# Altium schematic sheet Translate to rigid Flex gesture recognition.SchDoc
size 594 x 420 mm; SheetNumber: 1; SheetTotal: 16; SPICEModelCacheRCYREFEF: <root> / <DocumentId>RCYREFEF</DocumentId> / <CacheFrame Number="0"> / <Model Name="switch_array_u_sw_array_s11" Kind="CKT"> / <Text>*$ / .subckt SWITCH_ARRAY_U_SW_ARRAY_S11 1 2 3 4 / S_U_SW_ARRAY_S11         3 4 1 2 _U_SW_ARRAY_S11 / RS_U_SW_ARRAY_S11         1 2 1G / .MODEL         _U_SW_ARRAY_S11 VSWITCH Roff=1e12 Ron=300m Voff=0.2V Von=0.8V / .ends SWITCH_ARRAY_U_SW_ARRAY_S11</Text> / </Model> / </CacheFrame> / </root>
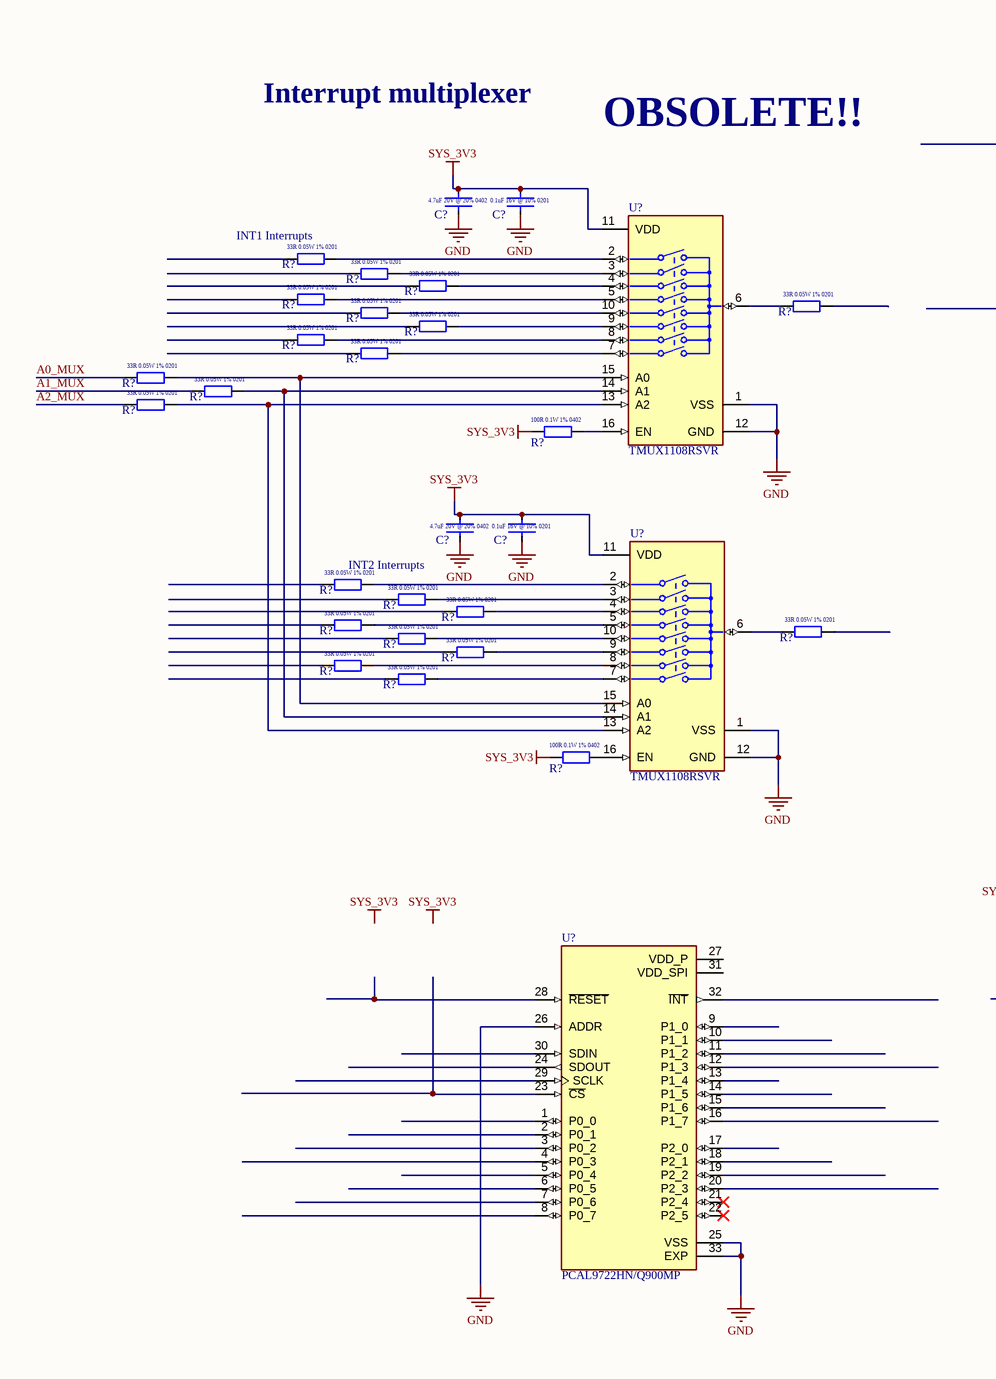
[diagram p0: Translate to rigid Flex gesture recognition.SchDoc, left]
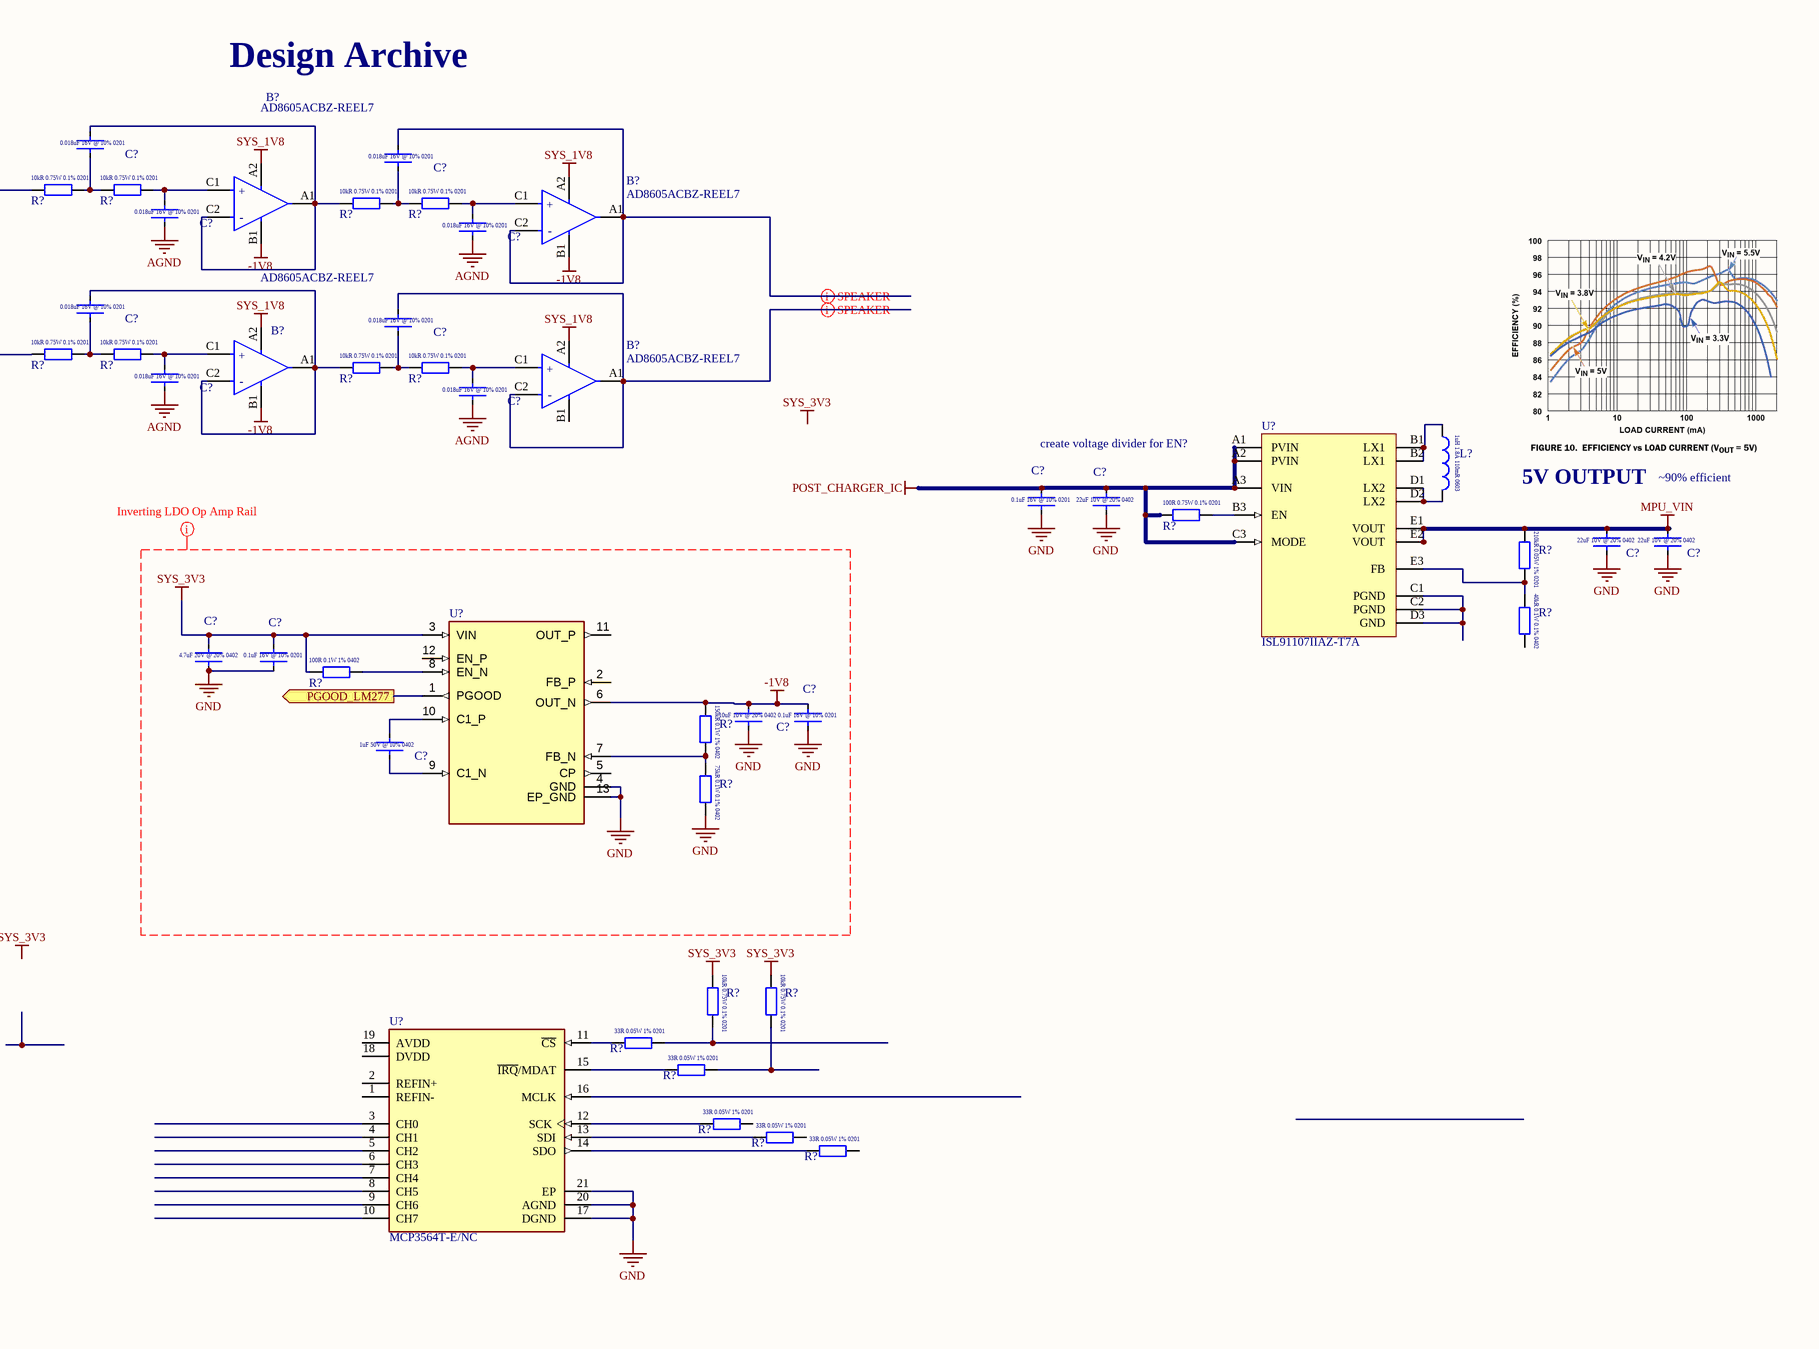
[diagram p1: Translate to rigid Flex gesture recognition.SchDoc, right]

## Parts
(Parts that share a designator on the sheet are numbered #1, #2 ... from top to bottom, then left to right.)
B?#1  AD8605ACBZ-REEL7  [FP-CB-5-1-MFG]
B?#2  AD8605ACBZ-REEL7  [FP-CB-5-1-MFG]
B?#3  AD8605ACBZ-REEL7  [FP-CB-5-1-MFG]
B?#4  AD8605ACBZ-REEL7  [FP-CB-5-1-MFG]
C?#1  GRM033R61C183KE84D  [CAPC0603X03L]  (value not drawn)
C?#2  GRM033R61C183KE84D  [CAPC0603X03L]  (value not drawn)
C?#3  GRM033R61C183KE84D  [CAPC0603X03L]  (value not drawn)
C?#4  GRM033R61C183KE84D  [CAPC0603X03L]  (value not drawn)
C?#5  4.7uF  [CAPC1005X06L]  (value not drawn)
C?#6  0.1uF  [CAPC0603X03L]  (value not drawn)
C?#7  GRM033R61C183KE84D  [CAPC0603X03L]  (value not drawn)
C?#8  GRM033R61C183KE84D  [CAPC0603X03L]  (value not drawn)
C?#9  GRM033R61C183KE84D  [CAPC0603X03L]  (value not drawn)
C?#10  GRM033R61C183KE84D  [CAPC0603X03L]  (value not drawn)
C?#11  0.1uF  [CAPC0603X03L]  (value not drawn)
C?#12  GRM158R61A226ME15D  [CAPC1005X06L]  (value not drawn)
C?#13  GRM158R61A226ME15D  [CAPC1005X06L]  (value not drawn)
C?#14  GRM158R61A226ME15D  [CAPC1005X06L]  (value not drawn)
C?#15  4.7uF  [CAPC1005X06L]  (value not drawn)
C?#16  0.1uF  [CAPC0603X03L]  (value not drawn)
C?#17  4.7uF  [CAPC1005X06L]  (value not drawn)
C?#18  0.1uF  [CAPC0603X03L]  (value not drawn)
C?#19  GRT155R61A106ME13J  [CAPC1005X06L]  (value not drawn)
C?#20  0.1uF  [CAPC0603X03L]  (value not drawn)
C?#21  GRM155R61H105KE05D  [CAPC1005X06L]  (value not drawn)
L?  IHHP0603ZHER1R0M01  [INDC1608LPX08L]  (value not drawn)
R?#1  TNPW020110K0BEED  [RESC0603X03N]  (value not drawn)
R?#2  TNPW020110K0BEED  [RESC0603X03N]  (value not drawn)
R?#3  TNPW020110K0BEED  [RESC0603X03N]  (value not drawn)
R?#4  TNPW020110K0BEED  [RESC0603X03N]  (value not drawn)
R?#5  ERJ-1GNF33R0C  [RESC0603X03L]  (value not drawn)
R?#6  ERJ-1GNF33R0C  [RESC0603X03L]  (value not drawn)
R?#7  ERJ-1GNF33R0C  [RESC0603X03L]  (value not drawn)
R?#8  ERJ-1GNF33R0C  [RESC0603X03L]  (value not drawn)
R?#9  ERJ-1GNF33R0C  [RESC0603X03L]  (value not drawn)
R?#10  TNPW020110K0BEED  [RESC0603X03N]  (value not drawn)
R?#11  TNPW020110K0BEED  [RESC0603X03N]  (value not drawn)
R?#12  ERJ-1GNF33R0C  [RESC0603X03L]  (value not drawn)
R?#13  TNPW020110K0BEED  [RESC0603X03N]  (value not drawn)
R?#14  TNPW020110K0BEED  [RESC0603X03N]  (value not drawn)
R?#15  ERJ-1GNF33R0C  [RESC0603X03L]  (value not drawn)
R?#16  ERJ-1GNF33R0C  [RESC0603X03L]  (value not drawn)
R?#17  ERJ-1GNF33R0C  [RESC0603X03L]  (value not drawn)
R?#18  ERJ-1GNF33R0C  [RESC0603X03L]  (value not drawn)
R?#19  ERJ-1GNF33R0C  [RESC0603X03L]  (value not drawn)
R?#20  ERJ-1GNF33R0C  [RESC0603X03L]  (value not drawn)
R?#21  ERJ-2RKF1000X  [RESC1005X04L]  (value not drawn)
R?#22  TNPW0201100RBEED  [RESC0603X03L]  (value not drawn)
R?#23  ERJ-1GNF2103C  [RESC0603X03L]  (value not drawn)
R?#24  RNCF0402BTE40K0  [RESC1005X04L]  (value not drawn)
R?#25  ERJ-1GNF33R0C  [RESC0603X03L]  (value not drawn)
R?#26  ERJ-1GNF33R0C  [RESC0603X03L]  (value not drawn)
R?#27  ERJ-1GNF33R0C  [RESC0603X03L]  (value not drawn)
R?#28  ERJ-1GNF33R0C  [RESC0603X03L]  (value not drawn)
R?#29  ERJ-2RKF1000X  [RESC1005X04L]  (value not drawn)
R?#30  ERJ-1GNF33R0C  [RESC0603X03L]  (value not drawn)
R?#31  ERJ-1GNF33R0C  [RESC0603X03L]  (value not drawn)
R?#32  ERJ-1GNF33R0C  [RESC0603X03L]  (value not drawn)
R?#33  ERJ-1GNF33R0C  [RESC0603X03L]  (value not drawn)
R?#34  ERJ-1GNF33R0C  [RESC0603X03L]  (value not drawn)
R?#35  RK73H1ETTP1503F  [RESC1005X04L]  (value not drawn)
R?#36  RP73PF1E75KBTD  [RESC1005X04L]  (value not drawn)
R?#37  ERJ-2RKF1000X  [RESC1005X04L]  (value not drawn)
R?#38  TNPW020110K0BEED  [RESC0603X03N]  (value not drawn)
R?#39  TNPW020110K0BEED  [RESC0603X03N]  (value not drawn)
R?#40  ERJ-1GNF33R0C  [RESC0603X03L]  (value not drawn)
R?#41  ERJ-1GNF33R0C  [RESC0603X03L]  (value not drawn)
R?#42  ERJ-1GNF33R0C  [RESC0603X03L]  (value not drawn)
R?#43  ERJ-1GNF33R0C  [RESC0603X03L]  (value not drawn)
R?#44  ERJ-1GNF33R0C  [RESC0603X03L]  (value not drawn)
U?#1  TMUX1108RSVR  [FP-RSV0016A-MFG]
U?#2  ISL91107IIAZ-T7A  [W3x5_15_MFG]
U?#3  TMUX1108RSVR  [FP-RSV0016A-MFG]
U?#4  LM27762DSST  [VREG_LM27762DSSR]  (value not drawn)
U?#5  MCP3564T-E/NC  [FP-C04-264-IPC_B]
U?#6  PCAL9722HN/Q900MP  [IC_PCAL9722HN/Q900MP]

## Ports
PGOOD_LM277 (out, see Main Page[3B])

## Nets
-1V8: B?#1.B1(V-) B?#2.B1(V-) B?#3.B1(V-) C?#19.2 C?#20.2 R?#35.1 U?#4.6(OUT_N)
AGND: C?#3.1 C?#4.1 C?#9.1 C?#10.1
GND: C?#5.1 C?#6.1 C?#11.1 C?#12.1 C?#13.1 C?#14.1 C?#15.1 C?#16.1 C?#17.1 C?#18.1 C?#19.1 C?#20.1 R?#36.2 U?#1.1(VSS) U?#1.12(GND) U?#3.1(VSS) U?#3.12(GND) U?#4.4(GND) U?#4.13(EP_GND) U?#5.17(DGND) U?#5.20(AGND) U?#5.21(EP) U?#6.25(VSS) U?#6.26(ADDR) U?#6.33(EXP)
MPU_VIN: C?#13.2 C?#14.2 R?#23.1 U?#2.E1(VOUT) U?#2.E2(VOUT)
POST_CHARGER_IC: C?#11.2 C?#12.2 R?#22.1 U?#2.A1(PVIN) U?#2.A2(PVIN) U?#2.A3(VIN) U?#2.C3(MODE)
SYS_1V8: B?#1.A2(V+) B?#2.A2(V+) B?#3.A2(V+) B?#4.A2(V+)
SYS_3V3: C?#5.2 C?#6.2 C?#15.2 C?#16.2 C?#17.2 C?#18.2 R?#21.1 R?#29.1 R?#37.1 R?#38.1 R?#39.1 U?#1.11(VDD) U?#3.11(VDD) U?#4.3(VIN)
A0_MUX: R?#18.1
A1_MUX: R?#19.1
A2_MUX: R?#20.1
PGOOD_LM277: U?#4.1(PGOOD) ; port PGOOD_LM277
NetB?#1_A1: B?#1.A1(OUT) B?#1.C2(-IN) C?#1.2 R?#3.1
NetB?#1_C1: B?#1.C1(+IN) C?#3.2 R?#2.2
NetB?#2_A1: B?#2.A1(OUT) B?#2.C2(-IN) C?#2.2
NetB?#2_C1: B?#2.C1(+IN) C?#4.2 R?#4.2
NetB?#3_A1: B?#3.A1(OUT) B?#3.C2(-IN) C?#7.2 R?#13.1
NetB?#3_C1: B?#3.C1(+IN) C?#9.2 R?#11.2
NetB?#4_A1: B?#4.A1(OUT) B?#4.C2(-IN) C?#8.2
NetB?#4_C1: B?#4.C1(+IN) C?#10.2 R?#14.2
NetC?#1_1: C?#1.1 R?#1.2 R?#2.1
NetC?#2_1: C?#2.1 R?#3.2 R?#4.1
NetC?#7_1: C?#7.1 R?#10.2 R?#11.1
NetC?#8_1: C?#8.1 R?#13.2 R?#14.1
NetC?#21_1: C?#21.1 U?#4.9(C1_N)
NetC?#21_2: C?#21.2 U?#4.10(C1_P)
NetL?_1: L?.1 U?#2.B1(LX1) U?#2.B2(LX1)
NetL?_2: L?.2 U?#2.D1(LX2) U?#2.D2(LX2)
NetR?#5_2: R?#5.2 U?#1.2(S1)
NetR?#6_2: R?#6.2 U?#1.3(S2)
NetR?#7_2: R?#7.2 U?#1.4(S3)
NetR?#8_2: R?#8.2 U?#1.5(S4)
NetR?#9_1: R?#9.1 U?#1.6(D)
NetR?#12_2: R?#12.2 U?#1.10(S5)
NetR?#15_2: R?#15.2 U?#1.9(S6)
NetR?#16_2: R?#16.2 U?#1.8(S7)
NetR?#17_2: R?#17.2 U?#1.7(S8)
NetR?#18_2: R?#18.2 U?#1.15(A0) U?#3.15(A0)
NetR?#19_2: R?#19.2 U?#1.14(A1) U?#3.14(A1)
NetR?#20_2: R?#20.2 U?#1.13(A2) U?#3.13(A2)
NetR?#21_2: R?#21.2 U?#1.16(EN)
NetR?#22_2: R?#22.2 U?#2.B3(EN)
NetR?#23_2: R?#23.2 R?#24.1 U?#2.E3(FB)
NetR?#25_2: R?#25.2 U?#3.2(S1)
NetR?#26_2: R?#26.2 U?#3.3(S2)
NetR?#27_2: R?#27.2 U?#3.4(S3)
NetR?#28_2: R?#28.2 U?#3.5(S4)
NetR?#29_2: R?#29.2 U?#4.8(EN_N)
NetR?#30_1: R?#30.1 U?#3.6(D)
NetR?#31_2: R?#31.2 U?#3.10(S5)
NetR?#32_2: R?#32.2 U?#3.9(S6)
NetR?#33_2: R?#33.2 U?#3.8(S7)
NetR?#34_2: R?#34.2 U?#3.7(S8)
NetR?#35_2: R?#35.2 R?#36.1 U?#4.7(FB_N)
NetR?#37_2: R?#37.2 U?#3.16(EN)
NetR?#38_2: R?#38.2 R?#40.2
NetR?#39_2: R?#39.2 R?#41.2
NetR?#40_1: R?#40.1 U?#5.11(~{CS})
NetR?#41_1: R?#41.1 U?#5.15(~{IRQ}/MDAT)
NetR?#42_1: R?#42.1 U?#5.12(SCK)
NetR?#43_1: R?#43.1 U?#5.13(SDI)
NetR?#44_1: R?#44.1 U?#5.14(SDO)
NetU?#2_C1: U?#2.C1(PGND) U?#2.C2(PGND) U?#2.D3(GND)

Not connected (* = marked no-connect by the designer): B?#4 B1(V-); R?#1 1; R?#5 1; R?#6 1; R?#7 1; R?#8 1; R?#9 2; R?#10 1; R?#12 1; R?#15 1; R?#16 1; R?#17 1; R?#24 2; R?#25 1; R?#26 1; R?#27 1; R?#28 1; R?#30 2; R?#31 1; R?#32 1; R?#33 1; R?#34 1; R?#42 2; R?#43 2; R?#44 2; U?#4 2(FB_P) 5(CP) 11(OUT_P) 12(EN_P); U?#5 1(REFIN-) 2(REFIN+) 3(CH0) 4(CH1) 5(CH2) 6(CH3) 7(CH4) 8(CH5) 9(CH6) 10(CH7) 16(MCLK) 18(DVDD) 19(AVDD); U?#6 1(P0_0) 2(P0_1) 3(P0_2) 4(P0_3) 5(P0_4) 6(P0_5) 7(P0_6) 8(P0_7) 9(P1_0) 10(P1_1) 11(P1_2) 12(P1_3) 13(P1_4) 14(P1_5) 15(P1_6) 16(P1_7) 17(P2_0) 18(P2_1) 19(P2_2) 20(P2_3) 21(P2_4)* 22(P2_5)* 23(~{CS}) 24(SDOUT) 27(VDD_P) 28(~{RESET}) 29(SCLK) 30(SDIN) 31(VDD_SPI) 32(~{INT})

## Layout directives
differential pair: NetB?#2_A1, NetB?#4_A1
net class Inverting LDO Op Amp Neg Rail: -1V8, GND, SYS_3V3

## Notes on the sheet
- Design Archive
- Interrupt multiplexer
- OBSOLETE!!
- (near R?#5) INT1 Interrupts
- create voltage divider for EN?
- 5V OUTPUT
- (near C?#14) ~90% efficient
- (near R?#25) INT2 Interrupts
- Labels drawn without touching a wire or pin: SYS_3V3
- DWG NO:
- REV:
- THIS DOCUMENT AND THE DATA DISCLOSED HEREIN OR
- HEREWITH IS THE PROPERTY OF ALTIUM LIMITED AND MAY
- BE FREELY DISTRIBUTED IN WHOLE. NO RIGHTS ARE
- RESERVED OR EXPRESS OR IMPLIED WARANTEE GIVEN.
- REVISION
- DESCRIPTION
- DATE
- APPROVED
- ENG:
- APPROVALS
- PROJECT
- DSN:
- CHK:
- REFERENCE DOCUMENTS
- PROJECT REVISION:
- TITLE
- DOCUMENT REVISION:
- DESIGN ITEM:
- BOM:
- FAB DWG:
- PCB DWG:
- ASSY DWG:
- SCALE:
- A2
- SIZE
- CAGE CODE
- FILE NAME
- DWG NO.
- SHEET
- OF
- REV
- (in symbol CL05A475MO5NUNC) 4.7uF 20V @ 20% 0402
- (in symbol CMP-0384-00007-3) +; -
- (in symbol ERJ-1GNF33R0C) 33R 0.05W 1% 0201
- (in symbol ERJ-1GNF2103C) 210kR 0.05W 1% 0201
- (in symbol ERJ-2RKF1000X) 100R 0.1W 1% 0402
- (in symbol GRM033R61C183KE84D) 0.018uF 16V @ 10% 0201
- (in symbol GRM033R61E104KE14J) 0.1uF 16V @ 10% 0201
- (in symbol GRM155R61H105KE05D) 1uF 50V @ 10% 0402
- (in symbol GRM158R61A226ME15D) 22uF 10V @ 20% 0402
- (in symbol GRT155R61A106ME13J) 10uF 10V @ 20% 0402
- (in symbol IHHP0603ZHER1R0M01) 1uH 1.8A 110mR 0603
- (in symbol RK73H1ETTP1503F) 150kR 0.1W 1% 0402
- (in symbol RNCF0402BTE40K0) 40kR 0.1W 0.1% 0402
- (in symbol RP73PF1E75KBTD) 75kR 0.1W 0.1% 0402
- (in symbol TNPW020110K0BEED) 10kR 0.75W 0.1% 0201
- (in symbol TNPW0201100RBEED) 100R 0.75W 0.1% 0201

## Library data of the parts
B?#1-B?#4 = CMP-0384-00007-3: IC OPAMP GP 1 CIRCUIT 5WLCSP; Gain Bandwidth Product: 10MHz; Common Mode Rejection Ratio: 85dB; Number of Circuits: 1; Operating Supply Current: 1.2mA; Amplifier Type: GENERAL PURPOSE; Input Offset Voltage (Vos): 300uV; Min Supply Voltage: 2.7V; Output Current per Channel: 80mA; Voltage Gain: 120dB; Power Supply Rejection Ratio (PSRR): 95dB; Input Voltage Noise Density: 8nV/sqrt Hz; Input Capacitance: 8.8pF; Slew Rate: 5V/µs; Max Supply Voltage: 5.5V; Input Bias Current: 1pA; Settling Time: 1us; Case/Package: BGA; Package Quantity: 1; Lead Free: Contains Lead; Number of Elements: 1; Min Operating Temperature: -40°C; Number of Amplifiers: 1; Radiation Hardening: No; Max Operating Temperature: 125°C; Unity Gain Bandwidth Product: 10MHz; RoHS Compliant: Yes; Bandwidth: 10MHz; Technology: CMOS; Contact Plating: Copper; REACH SVHC: No SVHC; Number of Pins: 5; Series: DigiTrim®; Packaging: Tape and Reel; Quiescent Current: 1.2mA; Number of Channels: 1
C?#1-C?#4 C?#7-C?#10 = GRM033R61C183KE84D: 0.018 µF ±10% 16V Ceramic Capacitor X5R 0201 (0603 Metric); ComponentLink1Description: New link; ComponentLink1URL: https://www.digikey.com.au/en/products/detail/murata-electronics/GRM033R61C183KE84D/5027499
C?#5 C?#15 C?#17 = CL05A475MO5NUNC: 4.7 µF ±20% 16V Ceramic Capacitor X5R 0402 (1005 Metric)
C?#6 C?#11 C?#16 C?#18 C?#20 = GRM033R61E104KE14J: 0.1 µF ±10% 25V Ceramic Capacitor X5R 0201 (0603 Metric)0.1 µF ±10% 25V Ceramic Capacitor X5R 0201 (0603 Metric); ComponentLink1Description: New link; ComponentLink1URL: https://www.digikey.com.au/en/products/detail/murata-electronics/GRM033R61E104KE14J/4904732?s=N4IgTCBcDaIOICUCyAGAzGhA2AjAURxQBYBpAogKRAF0BfIA
C?#12-C?#14 = GRM158R61A226ME15D: 22uH 0402; ComponentLink1Description: New link; ComponentLink1URL: https://www.digikey.com.au/en/products/detail/murata-electronics/GRM158R61A226ME15D/16033379
C?#19 = GRT155R61A106ME13J: 10 µF ±20% 10V Ceramic Capacitor X5R 0402 (1005 Metric); ComponentLink1Description: New link; ComponentLink1URL: https://www.digikey.com.au/en/products/detail/murata-electronics/GRT155R61A106ME13J/19115510
C?#21 = GRM155R61H105KE05D: 1 µF ±10% 50V Ceramic Capacitor X5R 0402 (1005 Metric); ComponentLink1Description: New link; ComponentLink1URL: https://www.digikey.com.au/en/products/detail/murata-electronics/GRM155R61H105KE05D/13531808
L? = IHHP0603ZHER1R0M01: 1 µH Shielded Inductor 1.8 A 110mOhm Max 0603 (1608 Metric); ComponentLink1Description: New link; ComponentLink1URL: https://www.digikey.com.au/en/products/detail/vishay-dale/IHHP0603ZHER1R0M01/16583528
R?#1-R?#4 R?#10 R?#11 R?#13 R?#14 R?#38 R?#39 = TNPW020110K0BEED: 10 kOhms ±0.1% 0.075W Chip Resistor 0201 (0603 Metric) Anti-Sulfur, Automotive AEC-Q200, Moisture Resistant Thin Film
R?#5-R?#9 R?#12 R?#15-R?#20 R?#25-R?#28 R?#30-R?#34 R?#40-R?#44 = ERJ-1GNF33R0C: 33 Ohms ±1% 0.05W, 1/20W Chip Resistor 0201 (0603 Metric) Thick Film; ComponentLink1Description: New link; ComponentLink1URL: https://www.digikey.com.au/en/products/detail/panasonic-electronic-components/ERJ-1GNF33R0C/2035941
R?#21 R?#29 R?#37 = ERJ-2RKF1000X: 100 Ohms ±1% 0.1W, 1/10W Chip Resistor 0402 (1005 Metric) Automotive AEC-Q200 Thick Film; ComponentLink1Description: New link; ComponentLink1URL: https://www.digikey.com.au/en/products/detail/panasonic-electronic-components/ERJ-2RKF1000X/192080
R?#22 = TNPW0201100RBEED: 100 Ohms ±0.1% 0.075W Chip Resistor 0201 (0603 Metric) Anti-Sulfur, Automotive AEC-Q200, Moisture Resistant Thin Film; Supplier 1: Mouser; Supplier Part Number 1: 71-TNPW0201100RBEED
R?#23 = ERJ-1GNF2103C: 210 kOhms ±1% 0.05W, 1/20W Chip Resistor 0201 (0603 Metric) Thick Film; ComponentLink1Description: New link; ComponentLink1URL: https://www.digikey.com.au/en/products/detail/panasonic-electronic-components/ERJ-1GNF2103C/2036374
R?#24 = RNCF0402BTE40K0: 40 kOhms ±0.1% 0.1W, 1/10W Chip Resistor 0402 (1005 Metric) Automotive AEC-Q200 Thin Film; ComponentLink1Description: New link; ComponentLink1URL: https://www.digikey.com.au/en/products/detail/stackpole-electronics-inc/RNCF0402BTE40K0/6259278
R?#35 = RK73H1ETTP1503F: 150 kOhms ±1% 0.1W, 1/10W Chip Resistor 0402 (1005 Metric) Automotive AEC-Q200 Thick Film; ComponentLink1Description: New link; ComponentLink1URL: https://www.digikey.com/en/products/detail/koa-speer-electronics-inc/RK73H1ETTP1503F/9844093
R?#36 = RP73PF1E75KBTD: 75 kOhms ±0.1% 0.1W, 1/10W Chip Resistor 0402 (1005 Metric) Thin Film; ComponentLink1Description: New link; ComponentLink1URL: https://www.digikey.com/en/products/detail/te-connectivity-passive-product/RP73PF1E75KBTD/8261041
U?#1 U?#3 = CMP-04892-000015-1: IC SWITCH SINGLE 16UQFN; Manufacturer: Texas Instruments; Max Junction Temp: +150°C; Min Supply Voltage: 1.08V; Standoff Height: 0mm; -3Db Bandwith: 90MHz; On State Resistance: 2.5Ω; Nominal Supply Current: 0.008uA; Number Of Circuits: 1; Max Supply Voltage: 5.5V; Digikey Description: IC SWITCH SINGLE 16UQFN; Ambient Temperature Range Low: -40°C; Ambient Temperature Range High: +125°C; ComponentLink2Description: Datasheet; Octopart: https://octopart.com/tmux1108rsvr-texas+instruments-96948107; Temperature Range High: +125°C; Temperature Range Low: -40°C; Height: 0.55mm; RoHS: TRUE; Lead Free: Yes; Automotive: No; Category: IC; Temperature: -40°C to +125°C; Package: RSV0016A; Device Class L2: Interface ICs; ComponentLink2URL: http://www.ti.com/lit/ds/symlink/tmux1108.pdf; Manufacturer Part Number: TMUX1108RSVR; Device Class L3: Multiplexers; Device Class L1: Integrated Circuits (ICs)
U?#2 = CMP-00572-88256049-2: ISL9110 Series 5.5 V 2.5 MHz High Efficiency Buck-Boost Regulator - WLCSP-15; Manufacturer Lifecycle Status: ACTIVE; Quiescent Current: 45µA; Min Supply Voltage: 1.8V; Max Output Current: 2A; Min Output Voltage: 1V; Switching Frequency: 2.5MHz; Max Supply Voltage: 5.5V; Pitch: 400µm; Max Junction Temperature (Tj): 125°C; Efficiency: 96%; Output Voltage: 5.2V; Lead Free: Lead Free; RoHS: Compliant; Number of Pins: 15; ComponentLink1URL: http://www.renesas.com; HelpURL: https://octopart.com/cad-content/api/get-model-datasheet/15189/88256049; ComponentLink1Description: Manufacturer's Website; Lifecycle Status: Production; ComponentLink2URL: https://octopart.com/cad-content/api/get-model-datasheet/15189/88256049; Mount: Surface Mount; ComponentLink3Description: Manufacturer's Package Drawing; Length: 2.1mm; Min Operating Temperature: -40°C; ComponentLink2Description: Datasheet URL; Max Operating Temperature: 85°C; ComponentLink3URL: https://www.renesas.com/en/document/psc/package-drawing-wlcsp-tkcurdl-15pin-w3x515; Height: 500µm; Max Output Voltage: 5.2V; Topology: Buck-Boost; Width: 1.5mm
U?#4 = LM27762DSST: Charge Pump Switching Regulator IC Positive and Negative (Dual Rail) Adjustable -5V, 1.5V 2 - Dual Output 250mA 12-WFDFN Exposed Pad; ComponentLink1Description: New link; ComponentLink1URL: https://www.digikey.com/en/products/detail/texas-instruments/LM27762DSSR/6235195
U?#5 = CMP-06267-000015-1: IC ADC 24BIT SIGMA-DELTA 20UQFN; Number of A/D Converters: 1; Number of Bits: 24; Number of Inputs: 4; Interface: SPI; Sampling Rate: 153600S/s; Max Operating Temperature: 125°C; Series: -; RoHS Compliant: Yes; Min Operating Temperature: -40°C; Mount: Surface Mount
U?#6 = PCAL9722HN/Q900MP: MF: {'manufacturer': u'NXP Semiconductors'}; Package: None; Price: None; Value: *; MP: PCAL9722HN/Q900MP; Availability: Unavailable